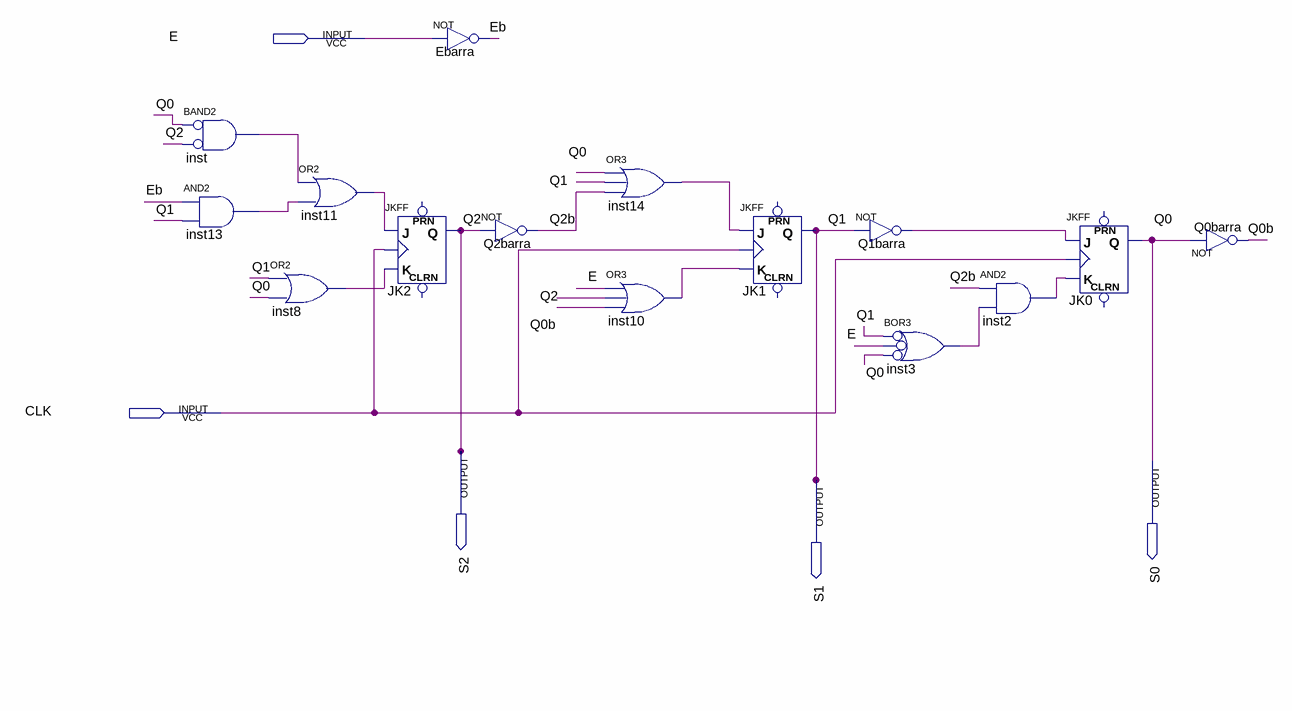
[diagram p0: schematic sheet]
// Quartus schematic Contador.bdf as structural Verilog: 15 symbols, 5 pins
module Contador (
  input  E,
  input  CLK,
  output S2,
  output S0,
  output S1
);

  wire Eb, inst2_out, inst3_out, inst8_out, inst10_out, inst11_out, inst13_out, inst14_out, inst_out, Q0b,
       Q1barra_out, Q2b;

  and inst (inst_out, ~S0, ~S2);  // BAND2
  and inst13 (inst13_out, Eb, S1);
  or inst11 (inst11_out, inst_out, inst13_out);
  or inst8 (inst8_out, S1, S0);
  JKFF JK2 (.K(inst8_out), .J(inst11_out), .CLK(CLK), .Q(S2));  // open: PRN, CLRN
  not Ebarra (Eb, E);
  not Q2barra (Q2b, S2);
  or inst14 (inst14_out, S0, S1, Q2b);
  or inst10 (inst10_out, E, S2, Q0b);
  JKFF JK1 (.K(inst10_out), .J(inst14_out), .CLK(CLK), .Q(S1));  // open: PRN, CLRN
  not Q1barra (Q1barra_out, S1);
  or inst3 (inst3_out, ~S1, ~E, ~S0);  // BOR3
  and inst2 (inst2_out, Q2b, inst3_out);
  JKFF JK0 (.K(inst2_out), .J(Q1barra_out), .CLK(CLK), .Q(S0));  // open: PRN, CLRN
  not Q0barra (Q0b, S0);

  // Other names for the same wires on the sheet: Q1 = S1; Q2 = S2; Q0 = S0
endmodule
